# Altium schematic sheet sd_card.SchDoc: SD Card Reader Header
size A4; DrawnBy: Hunter Kruger-Ilingworth; SheetNumber: 2; SheetTotal: 6
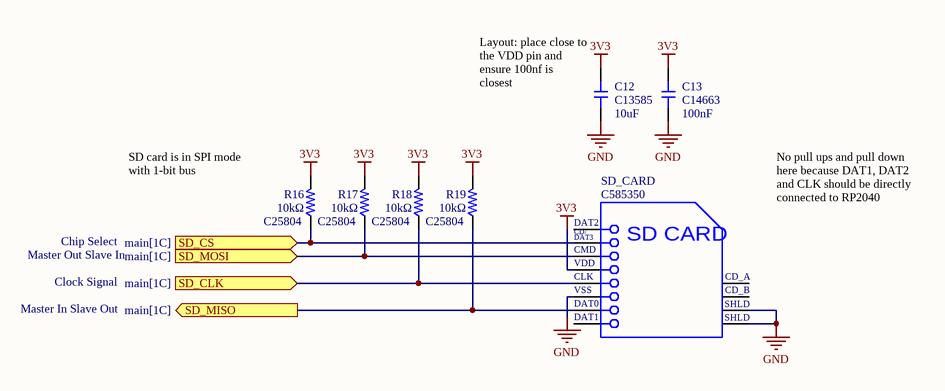
[diagram p0: sd_card.SchDoc]

## Parts
C12  Capacitance: 10uF  JLCPCB Part: C13585  [CAP-1206]  (hidden comment: CL31A106KBHNNNE)
C13  Capacitance: 100nF  JLCPCB Part: C14663  [CAP-0603]  (hidden comment: CC0603KRX7R9BB104)
R16  Resistance: 10kΩ  JLCPCB Part: C25804  [RES-0603]  (hidden comment: 0603WAF1002T5E)
R17  Resistance: 10kΩ  JLCPCB Part: C25804  [RES-0603]  (hidden comment: 0603WAF1002T5E)
R18  Resistance: 10kΩ  JLCPCB Part: C25804  [RES-0603]  (hidden comment: 0603WAF1002T5E)
R19  Resistance: 10kΩ  JLCPCB Part: C25804  [RES-0603]  (hidden comment: 0603WAF1002T5E)
SD_CARD  JLCPCB Part: C585350  [MOLX-104031-0811_V]  (hidden comment: 104031-0811)

## Ports
SD_CLK (in, see main[1C]), SD_CS (in, see main[1C]), SD_MISO (out, see main[1C]), SD_MOSI (in, see main[1C])

## Nets
3V3: C12.2 C13.2 R16.2 R17.2 R18.2 R19.2 SD_CARD.4(VDD)
GND: C12.1 C13.1 SD_CARD.6(VSS2) SD_CARD.11(SHLD1) SD_CARD.12(SHLD2)
SD_CLK: R18.1 SD_CARD.5(CLK) ; port SD_CLK
SD_CS: R16.1 SD_CARD.2(CMD) ; port SD_CS
SD_MISO: R19.1 SD_CARD.7(DAT0) ; port SD_MISO
SD_MOSI: R17.1 SD_CARD.3(VSS1) ; port SD_MOSI

Not connected (* = marked no-connect by the designer): SD_CARD 1(CD/DAT3) 8(DAT1) 9(CD_A) 10(CD_B)

## Notes on the sheet
- (near C12) Layout: place close to the VDD pin and ensure 100nf is closest
- (near R16) SD card is in SPI mode with 1-bit bus
- No pull ups and pull down here because DAT1, DAT2 and CLK should be directly connected to RP2040
- Master Out Slave In
- Clock Signal
- Chip Select
- Master In Slave Out
- Date:
- Sheet
- of
- Time:
- Revision:
- Drawn by:
- File:
- (in symbol CMP-2000-05825-1) DAT2; CD/; DAT3; SD CARD; VSS; SHLD

## Library data of the parts
C12 = CMP-001-00157-1: Capacitor, Ceramic (MLCC), 10uF, ±10%, 50V, X5R, ±10%, SMD 1206; Manufacturer: Samsung Electro-Mechanics; Package Size: 1206; Manufacturer Part Number: CL31A106KBHNNNE; JLCPCB Basic Part: Yes; Design Item ID: CL31A106KBHNNNE; ComponentLink2Description: JLCPCB Part URL; RoHS: Yes; ComponentLink1Description: Datasheet; ComponentLink3URL: https://lcsc.com/product-detail/Multilayer-Ceramic-Capacitors-MLCC---SMD-SMT_Samsung-Electro-Mechanics-Samsung-Electro-Mechanics-CL31A106KBHNNNE_C13585.html; ComponentLink3Description: LCSC Part URL; Tolerance: ±10%; Category: Capacitors - MLCC; Temperature Coefficient: X5R; JLCPCB Part Number: C13585; Voltage Rating: 50V; ComponentLink2URL: https://jlcpcb.com/partdetail/C13585; Source: jlcpcb_capacitors_basic.schlib; ComponentLink1URL: https://datasheet.lcsc.com/lcsc/1810221112_Samsung-Electro-Mechanics-CL31A106KBHNNNE_C13585.pdf
C13 = CMP-001-00167-1: Capacitor, Ceramic (MLCC), 100nF, ±10%, 50V, X7R, ±10%, SMD 0603; Manufacturer: YAGEO; ComponentLink1Description: Datasheet; Package Size: 0603; JLCPCB Part Number: C14663; Temperature Coefficient: X7R; JLCPCB Basic Part: Yes; RoHS: Yes; Source: jlcpcb_capacitors_basic.schlib; ComponentLink3URL: https://lcsc.com/product-detail/Multilayer-Ceramic-Capacitors-MLCC---SMD-SMT_YAGEO-YAGEO-CC0603KRX7R9BB104_C14663.html; Design Item ID: CC0603KRX7R9BB104; ComponentLink1URL: https://datasheet.lcsc.com/lcsc/1809301912_YAGEO-CC0603KRX7R9BB104_C14663.pdf; ComponentLink3Description: LCSC Part URL; Voltage Rating: 50V; ComponentLink2Description: JLCPCB Part URL; Category: Capacitors - MLCC; Tolerance: ±10%; Manufacturer Part Number: CC0603KRX7R9BB104; ComponentLink2URL: https://jlcpcb.com/partdetail/C14663
R16-R19 = CMP-009-00072-1: Resistor, 10kΩ, ±1%, 100mW, 75V, ±100ppm/℃, -55℃~+155℃, SMD 0603; Manufacturer: Uniroyal; Source: jlcpcb_resistors_basic.schlib; ComponentLink2Description: JLCPCB Part URL; ComponentLink1URL: https://datasheet.lcsc.com/lcsc/2206010045_UNI-ROYAL-Uniroyal-Elec-0603WAF1002T5E_C25804.pdf; ComponentLink2URL: https://jlcpcb.com/partdetail/C25804; Temperature Coefficient: ±100ppm/℃; Manufacturer Part Number: 0603WAF1002T5E; Power Rating: 100mW; ComponentLink1Description: Datasheet; Design Item ID: 0603WAF1002T5E; Category: Resistors; Tolerance: ±1%; Package Size: 0603; JLCPCB Basic Part: Yes; Temperature Rating: -55℃~+155℃; Voltage Rating: 75V
SD_CARD = CMP-2000-05825-1: Micro SD Card, RA, -25 to 85 degC, 8-Pin SMD, RoHS, Tape and Reel; Voltage Rating: 10VAC/DC; Number of Contacts: 8; Insertion - Extraction Style: Push-Pull; Pitch: 1.1mm; Mating Cycles: 10000; Brand: Molex; Current Rating: 500mA; Manufacturer URL: http://www.molex.com/; Card Type: microSD; Mounting Type: Standard; Height: 1.42mm; Mounting Technology: SurfaceMount; Contact Plating: Gold; Product Category: MemoryCardConnectors; Package Description: 8-Pin Surface Mount Device, Body 11.95 x 11.4 mm, Pitch 1.1 mm; Datasheet URL: http://www.molex.com/pdm_docs/sd/1040310811_sd.pdf; Termination Style: SMD; Length: 11.4mm; Housing Material: LiquidCrystalPolymer(LCP); Orientation: RightAngle; RoHS: True; Contact Material: PhosphorBronze; Datasheet Version: Rev. E, 04/2006; Packaging: Reel; Manufacturer: Molex; Series: 104031; Product: CardConnectors; Number of Rows: 1Row; Package Reference: 104031-0811